# Altium schematic sheet Encoder.SchDoc
size A; SheetNumber: 3; SheetTotal: 5
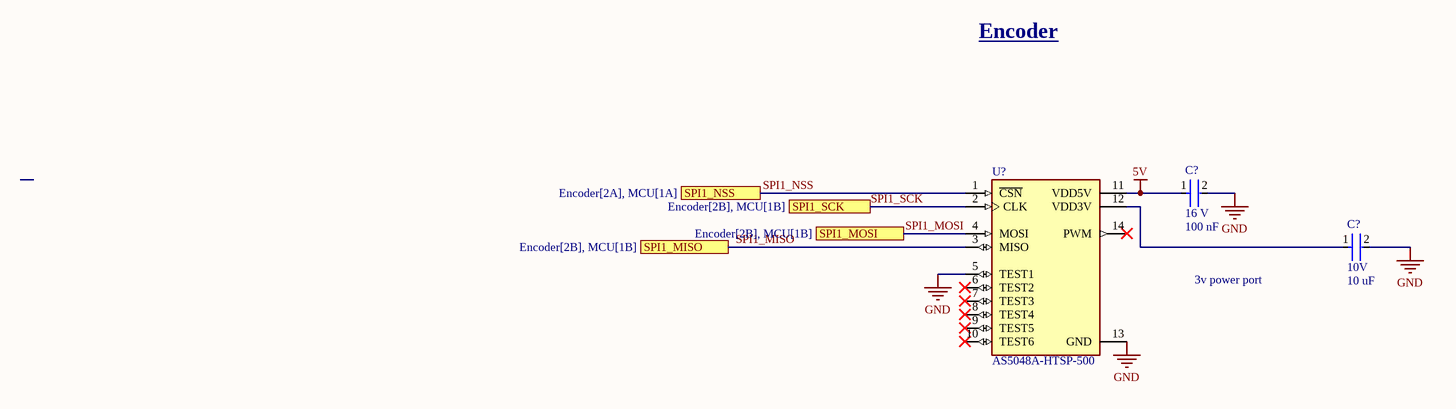
[diagram p0: Encoder.SchDoc]

## Parts
(Parts that share a designator on the sheet are numbered #1, #2 ... from top to bottom, then left to right.)
C?#1  Voltage Rating: 16 V  Capacitance: 100 nF  [CAP-0402]  (hidden comment: CC0402KRX7R7BB104)
C?#2  Voltage: 10V  Capacitance: 10 uF  [CAP-0603]  (hidden comment: CC0603KRX5R6BB106)
U?  AS5048A-HTSP-500  [SOP65P640X120-14N]

## Ports
SPI1_MISO (see Encoder[2B], MCU[1B]), SPI1_MOSI (see Encoder[2B], MCU[1B]), SPI1_NSS (see Encoder[2A], MCU[1A]), SPI1_SCK (see Encoder[2B], MCU[1B])

## Nets
5V: C?#1.1 U?.11(VDD5V)
GND: C?#1.2 C?#2.2 U?.5(TEST1) U?.13(GND)
SPI1_MISO: U?.3(MISO) ; port SPI1_MISO
SPI1_MOSI: U?.4(MOSI) ; port SPI1_MOSI
SPI1_NSS: U?.1(~{CSN}) ; port SPI1_NSS
SPI1_SCK: U?.2(CLK) ; port SPI1_SCK
NetC?#2_1: C?#2.1 U?.12(VDD3V)

Not connected (* = marked no-connect by the designer): U? 6(TEST2)* 7(TEST3)* 8(TEST4)* 9(TEST5)* 10(TEST6)* 14(PWM)*

## Notes on the sheet
- Encoder
- 3v power port

## Library data of the parts
C?#1 = CAP-0.1U-0001: CAP CER 0.1UF 16V X7R 0402; ComponentLink2Description: Datasheet; ComponentLink2URL: https://www.yageo.com/upload/media/product/productsearch/datasheet/mlcc/UPY-GPHC_X7R_6.3V-to-250V_24.pdf; Device Class: Ceramic; Size: 0402
C?#2 = CAP-10U-0001: CAP CER 10UF 10V X5R 0603; ComponentLink1Description: Datasheet; ComponentLink1URL: https://www.yageo.com/upload/media/product/app/datasheet/mlcc/upy-gphc_x5r_4v-to-50v.pdf; Device Class: Ceramic; Size: 0603
U? = ASB-ENCODER-SENSOR: Hall Effect Sensor Angle External Magnet, Not Included Gull Wing; MF: ams; SnapEDA_Link: https://www.snapeda.com/parts/AS5048A-HTSP-500/ams/view-part/?ref=snap; Package: TSSOP-14 ams; Value: *; MP: AS5048A-HTSP-500; Check_prices: https://www.snapeda.com/parts/AS5048A-HTSP-500/ams/view-part/?ref=eda